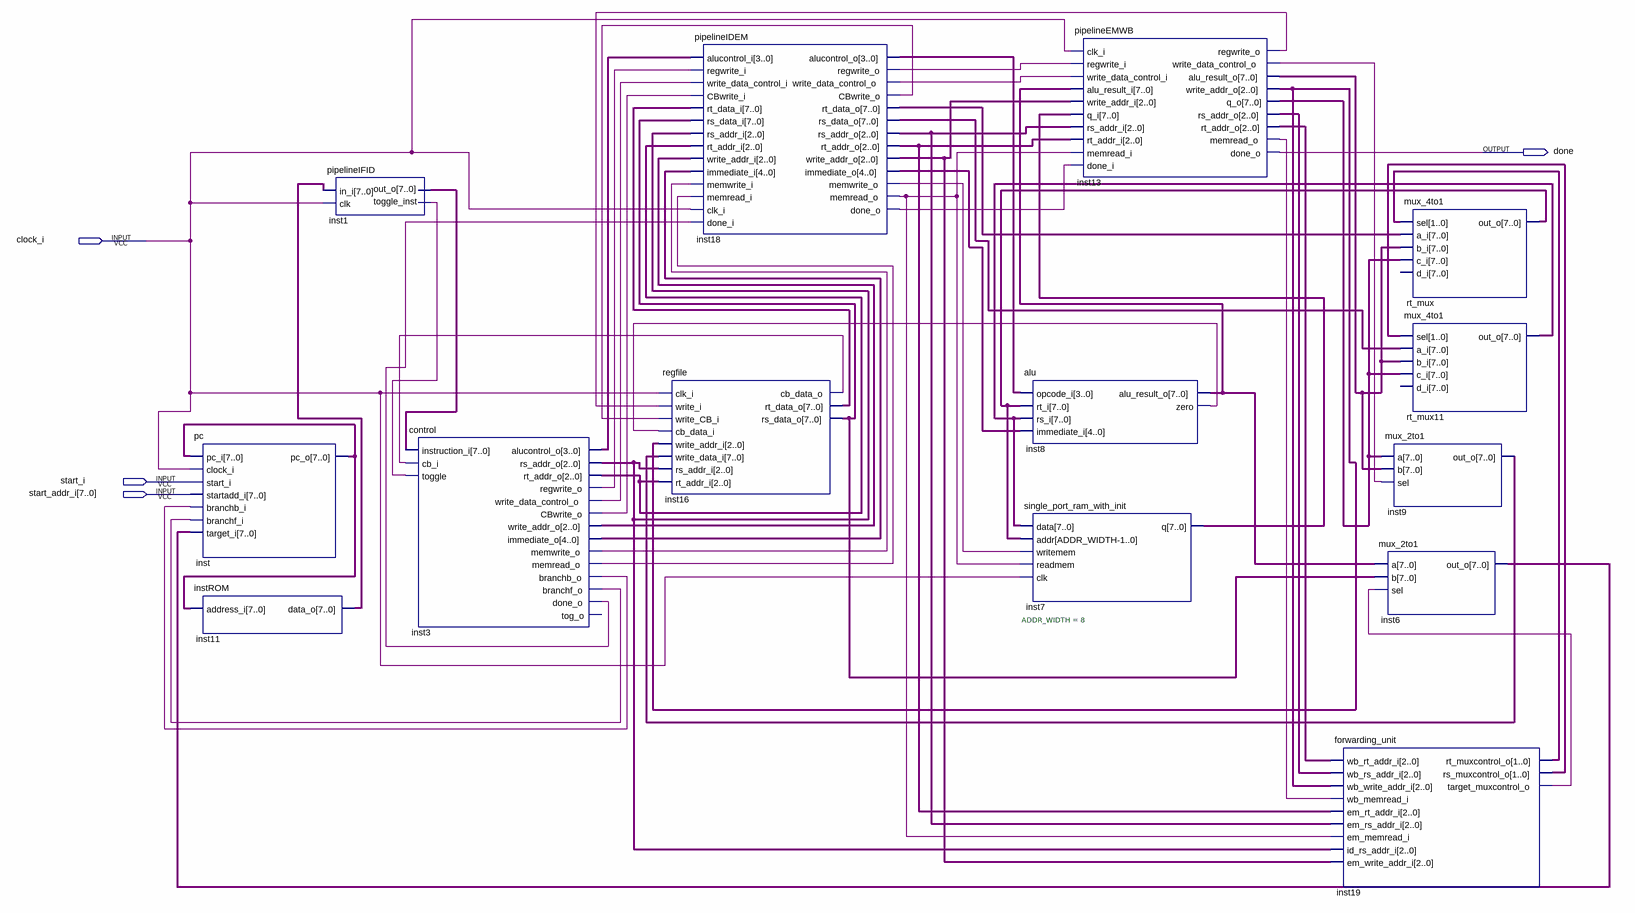
[diagram p0: schematic sheet]
// Quartus schematic reg_pu.bdf as structural Verilog: 14 symbols, 4 pins
module reg_pu (
  input  clock_i,
  input  start_i,
  input  [7:0] start_addr_i,
  output done
);

  wire inst1_toggle_inst, inst3_branchb_o, inst3_branchf_o, inst3_cbwrite_o, inst3_done_o, inst3_memread_o,
       inst3_memwrite_o, inst3_regwrite_o, inst3_write_data_control_o, inst8_zero, inst13_memread_o,
       inst13_regwrite_o, inst13_write_data_control_o, inst16_cb_data_o, inst18_cbwrite_o, inst18_done_o,
       inst18_memread_o, inst18_memwrite_o, inst18_regwrite_o, inst18_write_data_control_o,
       inst19_target_muxcontrol_o;
  wire [1:0] inst19_rs_muxcontrol_o, inst19_rt_muxcontrol_o;
  wire [2:0] inst3_rs_addr_o, inst3_rt_addr_o, inst3_write_addr_o, inst13_rs_addr_o, inst13_rt_addr_o,
       inst13_write_addr_o, inst18_rs_addr_o, inst18_rt_addr_o, inst18_write_addr_o;
  wire [3:0] inst3_alucontrol_o, inst18_alucontrol_o;
  wire [4:0] inst3_immediate_o, inst18_immediate_o;
  wire [7:0] inst1_out_o, inst6_out_o, inst7_q, inst8_alu_result_o, inst9_out_o, inst11_data_o,
       inst13_alu_result_o, inst13_q_o, inst16_rs_data_o, inst16_rt_data_o, inst18_rs_data_o,
       inst18_rt_data_o, inst_pc_o, rt_mux11_out_o, rt_mux_out_o;

  pc inst (
    .pc_i(inst_pc_o), .clock_i(clock_i), .start_i(start_i), .startadd_i(start_addr_i),
    .branchb_i(inst3_branchb_o), .branchf_i(inst3_branchf_o), .target_i(inst6_out_o), .pc_o(inst_pc_o));
  instROM inst11 (.address_i(inst_pc_o), .data_o(inst11_data_o));
  pipelineIFID inst1 (.in_i(inst11_data_o), .clk(clock_i), .out_o(inst1_out_o), .toggle_inst(inst1_toggle_inst));
  control inst3 (
    .instruction_i(inst1_out_o), .cb_i(inst16_cb_data_o), .toggle(inst1_toggle_inst),
    .alucontrol_o(inst3_alucontrol_o), .rs_addr_o(inst3_rs_addr_o), .rt_addr_o(inst3_rt_addr_o),
    .regwrite_o(inst3_regwrite_o), .write_data_control_o(inst3_write_data_control_o),
    .CBwrite_o(inst3_cbwrite_o), .write_addr_o(inst3_write_addr_o), .immediate_o(inst3_immediate_o),
    .memwrite_o(inst3_memwrite_o), .memread_o(inst3_memread_o), .branchb_o(inst3_branchb_o),
    .branchf_o(inst3_branchf_o), .done_o(inst3_done_o));  // open: tog_o
  regfile inst16 (
    .clk_i(clock_i), .write_i(inst13_regwrite_o), .write_CB_i(inst18_cbwrite_o), .cb_data_i(inst8_zero),
    .write_addr_i(inst13_write_addr_o), .write_data_i(inst9_out_o), .rs_addr_i(inst3_rs_addr_o),
    .rt_addr_i(inst3_rt_addr_o), .cb_data_o(inst16_cb_data_o), .rt_data_o(inst16_rt_data_o),
    .rs_data_o(inst16_rs_data_o));
  pipelineIDEM inst18 (
    .alucontrol_i(inst3_alucontrol_o), .regwrite_i(inst3_regwrite_o),
    .write_data_control_i(inst3_write_data_control_o), .CBwrite_i(inst3_cbwrite_o),
    .rt_data_i(inst16_rt_data_o), .rs_data_i(inst16_rs_data_o), .rs_addr_i(inst3_rs_addr_o),
    .rt_addr_i(inst3_rt_addr_o), .write_addr_i(inst3_write_addr_o), .immediate_i(inst3_immediate_o),
    .memwrite_i(inst3_memwrite_o), .memread_i(inst3_memread_o), .clk_i(clock_i), .done_i(inst3_done_o),
    .alucontrol_o(inst18_alucontrol_o), .regwrite_o(inst18_regwrite_o),
    .write_data_control_o(inst18_write_data_control_o), .CBwrite_o(inst18_cbwrite_o),
    .rt_data_o(inst18_rt_data_o), .rs_data_o(inst18_rs_data_o), .rs_addr_o(inst18_rs_addr_o),
    .rt_addr_o(inst18_rt_addr_o), .write_addr_o(inst18_write_addr_o), .immediate_o(inst18_immediate_o),
    .memwrite_o(inst18_memwrite_o), .memread_o(inst18_memread_o), .done_o(inst18_done_o));
  alu inst8 (
    .opcode_i(inst18_alucontrol_o), .rt_i(rt_mux_out_o), .rs_i(rt_mux11_out_o),
    .immediate_i(inst18_immediate_o), .alu_result_o(inst8_alu_result_o), .zero(inst8_zero));
  single_port_ram_with_init #(.ADDR_WIDTH(8)) inst7 (
    .data(rt_mux11_out_o), .addr(rt_mux_out_o), .writemem(inst18_memwrite_o), .readmem(inst18_memread_o),
    .clk(clock_i), .q(inst7_q));
  pipelineEMWB inst13 (
    .clk_i(clock_i), .regwrite_i(inst18_regwrite_o), .write_data_control_i(inst18_write_data_control_o),
    .alu_result_i(inst8_alu_result_o), .write_addr_i(inst18_write_addr_o), .q_i(inst7_q),
    .rs_addr_i(inst18_rs_addr_o), .rt_addr_i(inst18_rt_addr_o), .memread_i(inst18_memread_o),
    .done_i(inst18_done_o), .regwrite_o(inst13_regwrite_o),
    .write_data_control_o(inst13_write_data_control_o), .alu_result_o(inst13_alu_result_o),
    .write_addr_o(inst13_write_addr_o), .q_o(inst13_q_o), .rs_addr_o(inst13_rs_addr_o),
    .rt_addr_o(inst13_rt_addr_o), .memread_o(inst13_memread_o), .done_o(done));
  forwarding_unit inst19 (
    .wb_rt_addr_i(inst13_rt_addr_o), .wb_rs_addr_i(inst13_rs_addr_o), .wb_write_addr_i(inst13_write_addr_o),
    .wb_memread_i(inst13_memread_o), .em_rt_addr_i(inst18_rt_addr_o), .em_rs_addr_i(inst18_rs_addr_o),
    .em_memread_i(inst18_memread_o), .id_rs_addr_i(inst3_rs_addr_o), .em_write_addr_i(inst18_write_addr_o),
    .rt_muxcontrol_o(inst19_rt_muxcontrol_o), .rs_muxcontrol_o(inst19_rs_muxcontrol_o),
    .target_muxcontrol_o(inst19_target_muxcontrol_o));
  mux_2to1 inst9 (.a(inst13_q_o), .b(inst13_alu_result_o), .sel(inst13_write_data_control_o), .out_o(inst9_out_o));
  mux_2to1 inst6 (.a(inst8_alu_result_o), .b(inst16_rs_data_o), .sel(inst19_target_muxcontrol_o), .out_o(inst6_out_o));
  mux_4to1 rt_mux (
    .sel(inst19_rt_muxcontrol_o), .a_i(inst18_rt_data_o), .b_i(inst13_alu_result_o), .c_i(inst13_q_o),
    .out_o(rt_mux_out_o));  // open: d_i
  mux_4to1 rt_mux11 (
    .sel(inst19_rs_muxcontrol_o), .a_i(inst18_rs_data_o), .b_i(inst13_alu_result_o), .c_i(inst13_q_o),
    .out_o(rt_mux11_out_o));  // open: d_i
endmodule
